# EAGLE design PCB USB Pwr Module (EAGLE 6.3)
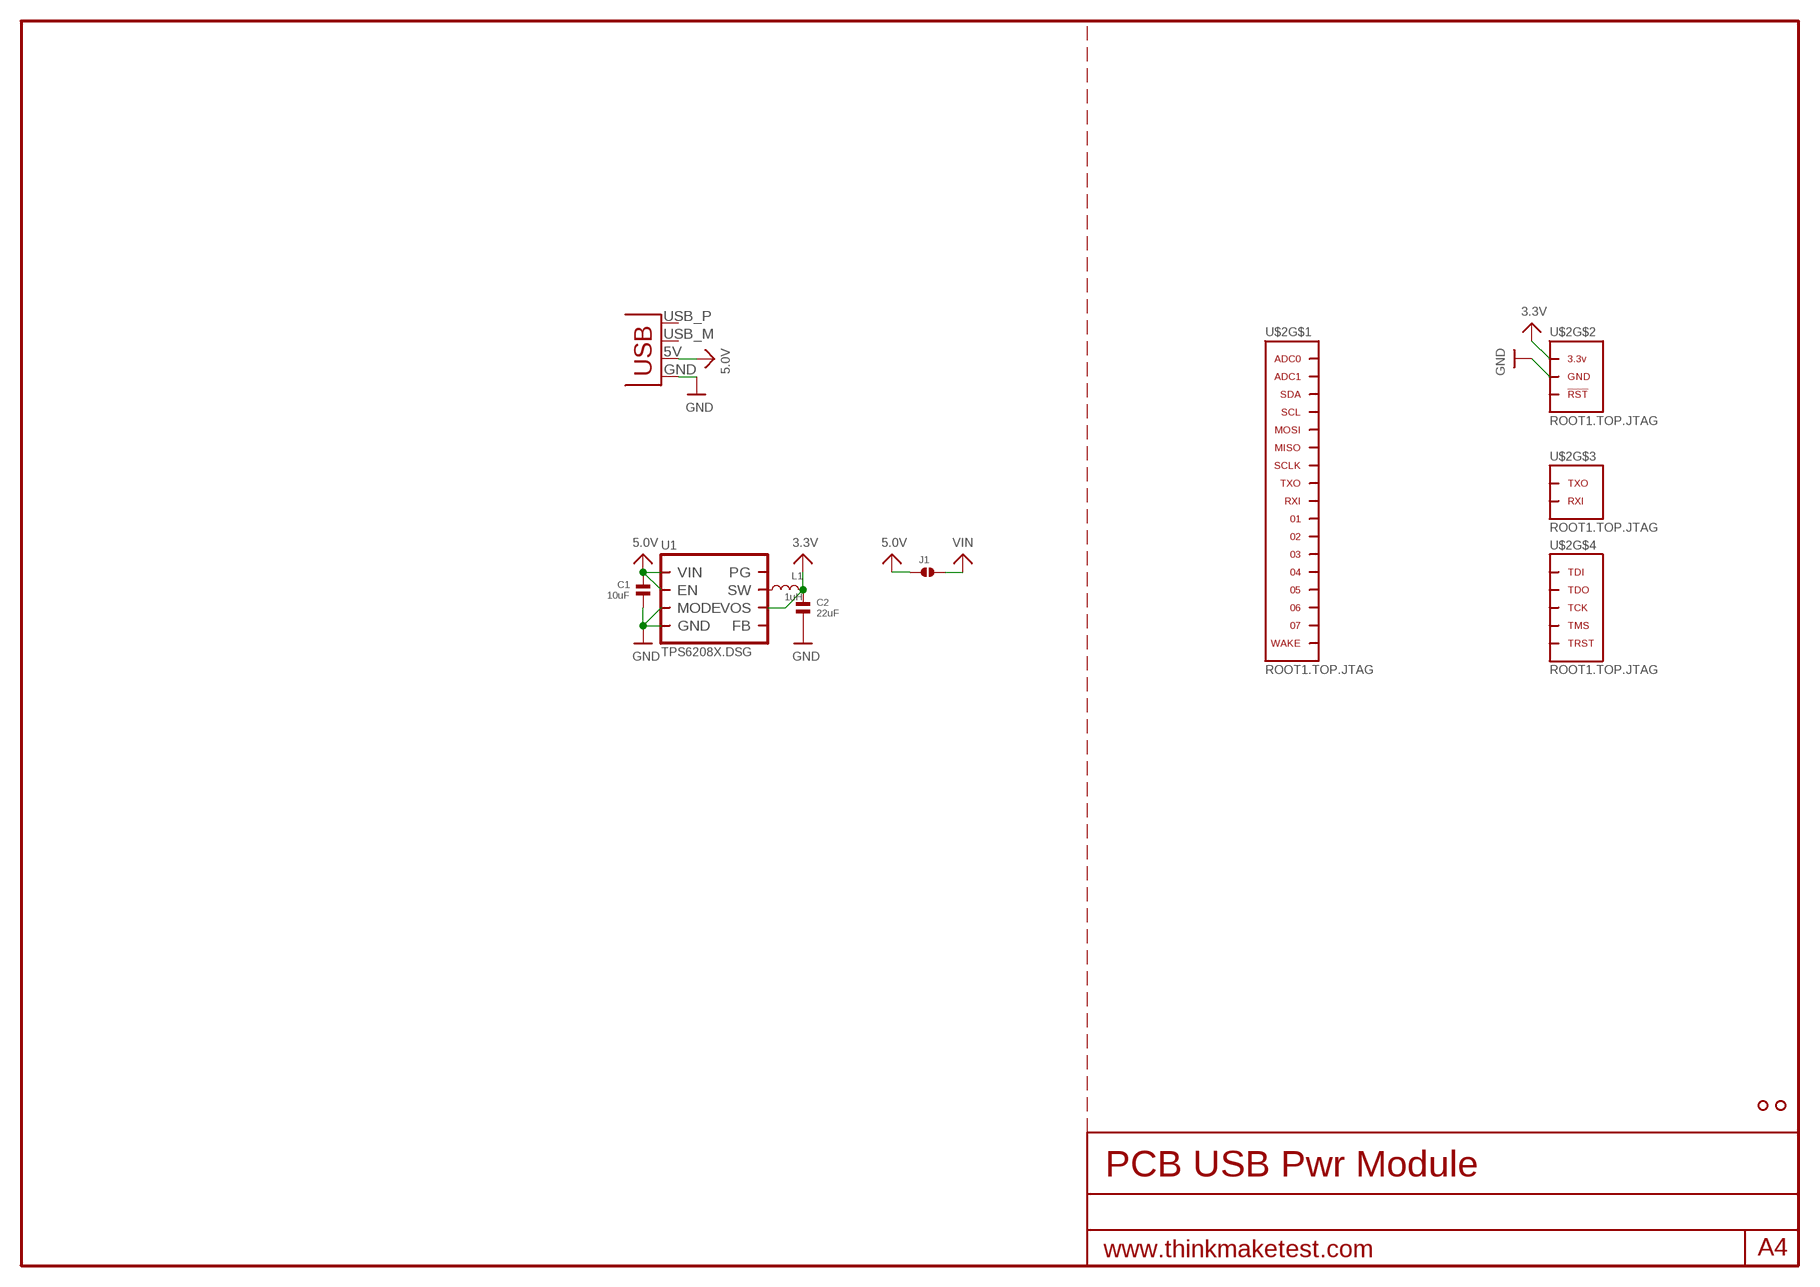
[diagram p0: schematic, sheet 1]

## Parts
C1  10uF  CAPACITOR.0603  [0603]
C2  22uF  CAPACITOR.0805  [0805]
J1  SOLDERJUMPER.2.LRG.PASTE  [2.LRG.PASTE]
JP1  USBPCB  [USB-A-PCB]
L1  1uH  INDUCTOR-SRN3015  [SRN3015]
U1  TPS6208X.DSG  [DSG]
U$2  ROOT1.TOP.JTAG  [ROOT1.TOP]
U$3  HOLE.#2  [#2]
U$4  HOLE.#2  [#2]

## Nets
3.3V: C2.1 L1.1 U1.5(VOS) U$2.3.3V@1(3.3V) U$2.3.3V@2(3.3V) U$2.3.3V@3(3.3V) U$2.3.3V@4(3.3V) U$2.3.3V@5(3.3V) U$2.3.3V@6(3.3V) U$2.3.3V@7(3.3V) U$2.3.3V@8(3.3V) U$2.3.3V@9(3.3V) U$2.3.3V@10(3.3V) U$2.3.3V@11(3.3V) U$2.3.3V@12(3.3V)
5.0V: C1.1 J1.1 JP1.5V(VBUS) U1.1(EN) U1.8(VIN)
GND: C1.2 C2.2 JP1.GND U1.2(GND) U1.3(MODE) U1.PAD(GND) U$2.GND@1(GND) U$2.GND@2(GND) U$2.GND@3(GND) U$2.GND@4(GND) U$2.GND@5(GND) U$2.GND@6(GND) U$2.GND@7(GND) U$2.GND@8(GND) U$2.GND@9(GND) U$2.GND@10(GND) U$2.GND@11(GND) U$2.GND@12(GND) U$2.GND@13(GND)
N$1: L1.2 U1.7(SW)
VIN: J1.2
Unconnected: JP1.USB_M(D-) JP1.USB_P(D+) U1.4(FB) U1.6(PG) U$2.01 U$2.02 U$2.03 U$2.04 U$2.05 U$2.06 U$2.07 U$2.ADC0 U$2.ADC1 U$2.MISO U$2.MOSI U$2.RST(!RST) U$2.RXI U$2.RXI.DBG(RXI) U$2.SCL U$2.SCLK U$2.SDA U$2.TCK U$2.TDI U$2.TDO U$2.TMS U$2.TRST U$2.TXO U$2.TXO.DBG(TXO) U$2.WAKE

## Library data of the parts
C1 C2 = .standardparts:CAPACITOR
J1 = .solderjumper:SOLDERJUMPER.2
JP1 = SparkFun-Connectors:USB: USB Connectors USB-B-PTH is fully proven SKU : PRT-00139/CONN-08278 USB-miniB is fully proven SKU : PRT-00587 USB-A-PCB is untested. USB-A-H is throughly reviewed, but untested. Spark Fun Electronics SKU : PRT-00437 USB-B-SMT is throughly reviewed, but untested. Needs silkscreen touching up. USB-A-S has not been used/tested USB-MB-H has not been used/tested USB-MICROB has been used. CONN-09505
L1 = bourns:INDUCTOR
U1 = .packages(ti):TPS6208X
U$2 = thinkmaketest:ROOT1
U$3 U$4 = .screw_holes:HOLE

## Board
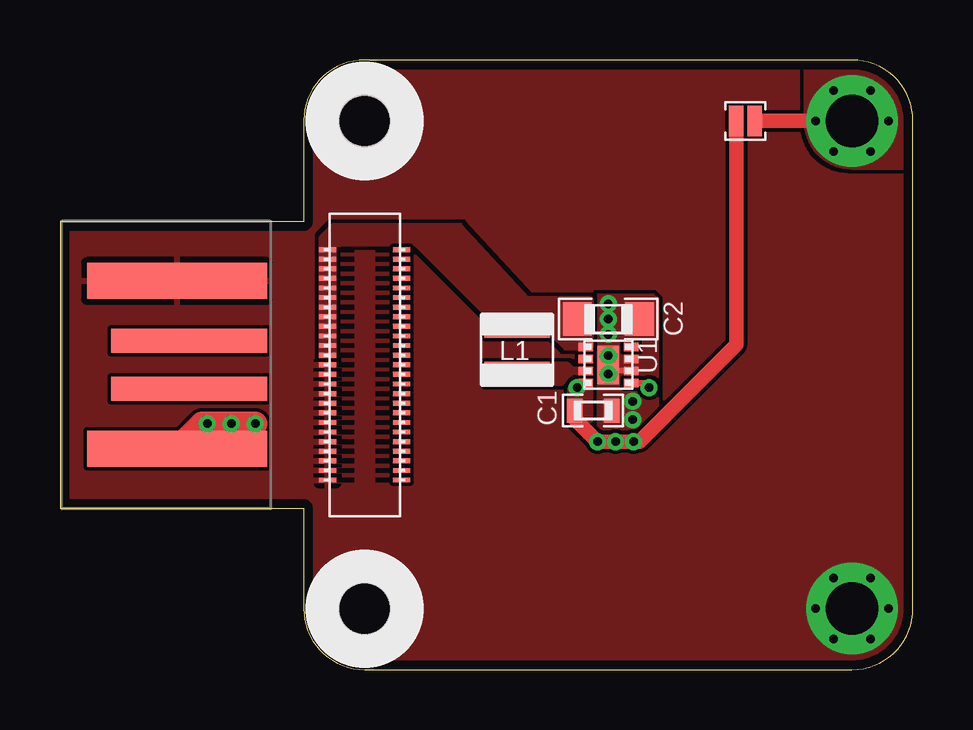
[diagram p1: board, top side]
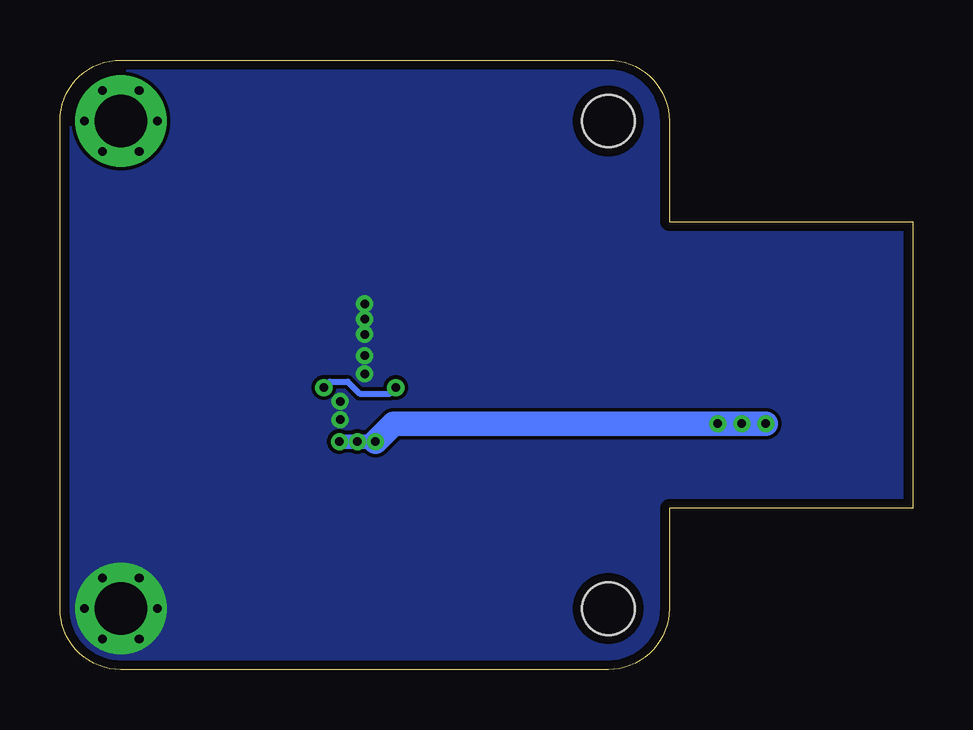
[diagram p2: board, bottom side, seen from below]

Size 35.56 x 25.4 mm. Coordinates in mm from the lower left corner, seen from the top.
Outline: 10.16,22.86 10.16,18.67 0,18.67 0,6.73 10.16,6.73 10.16,2.54 arc90 12.7,0 33.02,0 arc90 35.56,2.54 35.56,22.86 arc90 33.02,25.4 12.7,25.4 arc90 10.16,22.86
Copper layers (1*16): Top 0.0356mm / dielectric 1.5011mm / Bottom 0.0356mm
Design rules "default": minimum track width 6mil, minimum drill 13mil, track to track 6mil, track to pad 6mil, pad to pad 6mil, via to via 6mil, smd to smd 6mil, copper to edge 15mil, drill to drill 6mil, minimum pad ring 7mil, minimum via ring 7mil, stop-mask expansion 4mil, vias tented up to drill 16mil, thermal gap 10mil
tRestrict: 3 lines

### Footprints (pad centres in the part's own frame; a part is rotated, then mirrored left to right if it is on the bottom)
0603 = smd 0.65 x 1: 1 -0.775,0; 2 0.775,0
0805 = smd 1.2 x 1.4: 1 -1.3,0; 2 1.3,0
2.LRG.PASTE = smd 0.61 x 1.27: 1 -0.381,0; 2 0.381,0
USB-A-PCB = smd 7.5 x 1.5: 5V -0.2,-3.5; GND -0.2,3.5 | smd 6.5 x 1: USB_M 0.3,-1; USB_P 0.3,1
SRN3015 = smd 2.7 x 1: 1 0,1; 2 0,-1
DSG = smd 0.6 x 0.35: 1 -0.95,0.75; 2 -0.95,0.25; 3 -0.95,-0.25; 4 -0.95,-0.75; 5 0.95,-0.75; 6 0.95,-0.25; 7 0.95,0.25; 8 0.95,0.75 | smd 0.9 x 1.6: PAD 0,0
ROOT1.TOP = smd 0.7 x 0.2: 01 4.08,13.9; 02 4.08,13.5; 03 4.08,13.1; 3.3V@1 1,17.5; 3.3V@2 1,17.1; 3.3V@3 1,16.7; 3.3V@4 1,16.3; 3.3V@5 1,15.9; 3.3V@6 1,15.5; 3.3V@7 1,15.1; 3.3V@8 1,14.7; 3.3V@9 1,14.3; 3.3V@10 1,13.9; 3.3V@11 1,13.5; 3.3V@12 1,13.1; 04 4.08,12.7; 05 4.08,12.3; 06 4.08,11.9; 07 4.08,11.5; ADC0 4.08,17.5; ADC1 4.08,17.1; GND@1 1,7.9; GND@2 1,8.3; GND@3 1,8.7; GND@4 1,9.1; GND@5 1,9.5; GND@6 1,9.9; GND@7 1,10.3; GND@8 1,10.7; GND@9 1,11.1; GND@10 1,11.5; GND@11 1,11.9; GND@12 1,12.3; GND@13 1,12.7; MISO 4.08,15.5; MOSI 4.08,15.9; RST 4.08,7.9; RXI 4.08,14.3; RXI.DBG 4.08,10.3; SCL 4.08,16.3; SCLK 4.08,15.1; SDA 4.08,16.7; TCK 4.08,9.1; TDI 4.08,9.9; TDO 4.08,9.5; TMS 4.08,8.7; TRST 4.08,8.3; TXO 4.08,14.7; TXO.DBG 4.08,10.7; WAKE 4.08,11.1
#2 = hole 2.184: 0,0

### Placement (x,y rotation side)
C1  22.23,10.79 0 top
C2  22.86,14.61 0 top
J1  28.57,22.86 0 top
JP1  5.08,12.7 0 top
L1  19.05,13.34 0 top
U1  22.86,12.7 180 top
U$2  10.16,0 0 top
U$3  12.7,2.54 90 top
U$4  12.7,22.86 90 top

### Tracks (layer width: path | path; a pad name or v marks a point on that pad's centre or on a via)
3.3V
  pour Top (no thermals): 22.11,13.4 21.11,13.4 20.56,13.95 17.81,13.95 17.81,14.8 14.86,17.75 11.66,17.75 11.41,17.5 11.41,13 10.91,13 10.91,18 11.41,18.5 16.66,18.5 19.46,15.45 22.11,15.45
5.0V  (via drill 0.36)
  Top 0.254: U1.1 24.36,11.95 v24.56,11.75 | v21.56,11.75 21.76,11.95 U1.8
  Top 0.61: J1.1 28.19,13.53 24.16,9.5 v22.41,9.5 21.45,10.46 C1.1
  Top 1.016: JP1.5V 5.93,10.25 v8.14,10.25
  Bottom 0.254: v24.56,11.75 24.31,12 23.56,12 23.06,11.5 21.81,11.5 v21.56,11.75
  Bottom 0.61: v23.91,9.5 v23.16,9.5 v22.41,9.5
  Bottom 1.016: v22.41,9.5 21.66,10.25 v8.14,10.25 v7.14,10.25 v6.14,10.25
  pour Top (rank 2, no thermals): 22.11,12 21.41,12 21.26,11.85 21.26,10.4 22.11,10.4
GND  (via drill 0.36, 2.18 pad 3.81)
  Top 0.254: U1.2 23.11,12.45 U1.PAD
  other vias: 33.02,2.54 31.5,2.54 34.54,2.54 32.26,3.81 33.78,3.81 33.78,1.27 32.26,1.27 22.86,12.32 22.86,13.08 22.86,13.97 22.86,14.61 22.86,15.24 23.88,10.41 23.88,11.18
  pour Bottom (rank 6): 10.16,0 35.56,0 35.56,25.4 10.16,25.4 10.16,18.67 0,18.67 0,6.73 10.16,6.73
  pour Top (rank 6): 10.16,0 35.56,0 35.56,25.4 10.16,25.4 10.16,18.67 0,18.67 0,6.73 10.16,6.73
  pour Top (rank 3, no thermals): 22.31,10.25 22.31,15.5 25.06,15.5 25.06,11 24.06,10 22.56,10
N$1
  pour Top (no thermals): 22.11,12.5 21.36,12.5 21.16,12.7 17.86,12.7 17.86,11.95 20.91,11.95 21.36,12.4 22.11,12.4
VIN  (via drill 0.36, 2.18 pad 3.81)
  Top 0.61: J1.2 v33.02,22.86
  other vias: 34.54,22.86 31.5,22.86 32.26,24.13 33.78,24.13 33.78,21.59 32.26,21.59
  pour Top: 31.11,25.4 31.11,22.86 arc90 33.02,20.95 35.56,20.95 35.56,22.86 arc90 33.02,25.4

### Text on the board
tDocu: 5V to Vin
bDocu: v1 | Cruz Monrreal II | AnomalousMaker.com